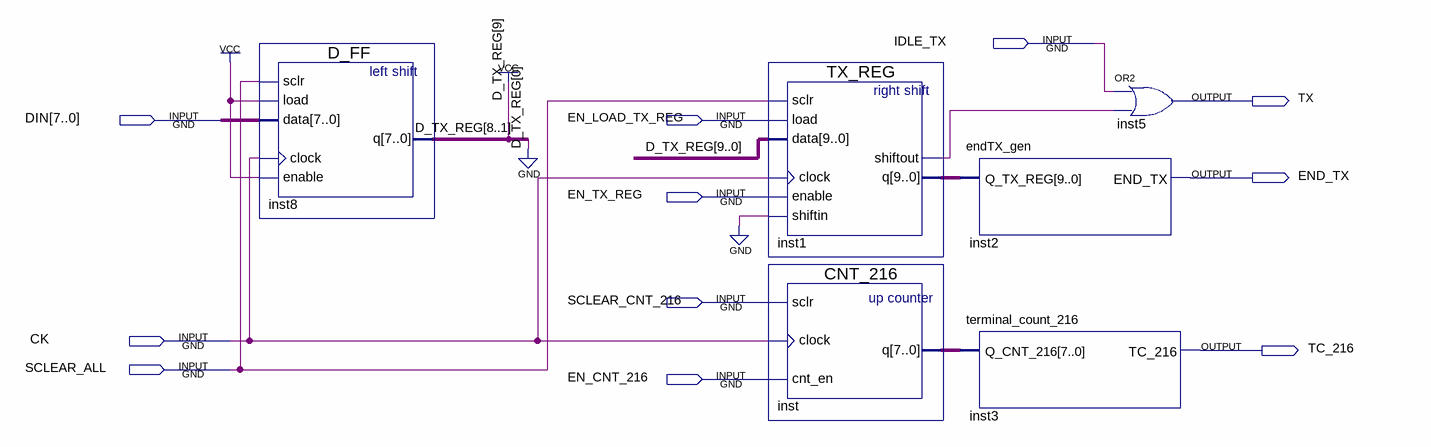
[diagram p0: schematic sheet]
// Quartus schematic uartTX_DP.bdf as structural Verilog: 6 symbols, 11 pins
module uartTX_DP (
  input  IDLE_TX,
  input  [7:0] DIN,
  input  EN_LOAD_TX_REG,
  input  EN_TX_REG,
  input  SCLEAR_CNT_216,
  input  CK,
  input  SCLEAR_ALL,
  input  EN_CNT_216,
  output TX,
  output END_TX,
  output TC_216
);

  wire inst1_shiftout;
  wire [7:0] inst_q;
  wire [8:1] D_TX_REG;
  wire [9:0] inst1_q;

  D_FF inst8 (.sclr(SCLEAR_ALL), .load(1'b1), .data(DIN), .clock(CK), .enable(1'b1), .q(D_TX_REG));
  TX_REG inst1 (
    .sclr(SCLEAR_ALL), .load(EN_LOAD_TX_REG), .data({1'b1, D_TX_REG, 1'b0}), .clock(CK), .enable(EN_TX_REG),
    .shiftin(1'b0), .shiftout(inst1_shiftout), .q(inst1_q));
  CNT_216 inst (.sclr(SCLEAR_CNT_216), .clock(CK), .cnt_en(EN_CNT_216), .q(inst_q));
  endTX_gen inst2 (.Q_TX_REG(inst1_q), .END_TX(END_TX));
  terminal_count_216 inst3 (.Q_CNT_216(inst_q), .TC_216(TC_216));
  or inst5 (TX, IDLE_TX, inst1_shiftout);
endmodule
